# Altium schematic sheet 5-NAND_FLASH.SchDoc
size A4
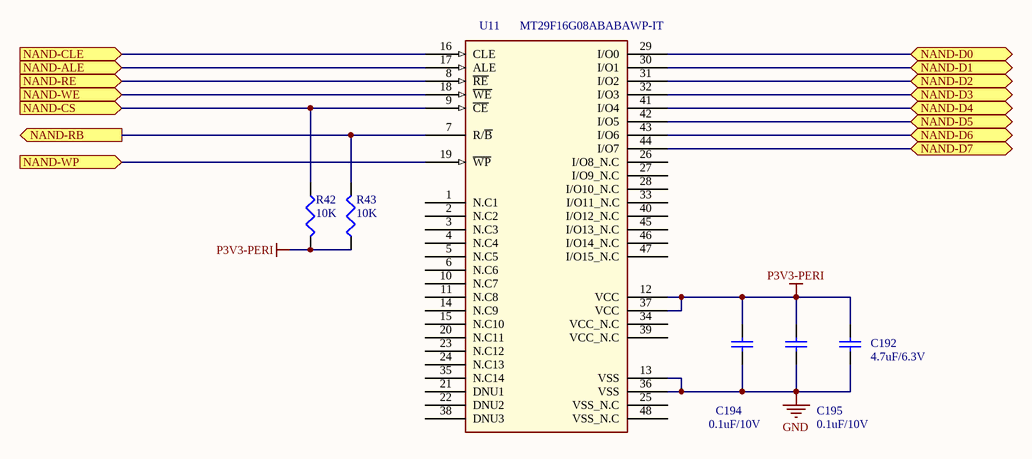
[diagram p0: 5-NAND_FLASH.SchDoc]

## Parts
C192  4.7uF/6.3V  [0603_CC]
C194  0.1uF/10V  [0402_CC]
C195  0.1uF/10V  [0402_CC]
R42  10K  [0402_CC]
R43  10K  [0402_CC]
U11  MT29F16G08ABABAWP-IT  [TSOP48]

## Ports
NAND-ALE (in), NAND-CLE (in), NAND-CS (in), NAND-D0 (bidir), NAND-D1 (bidir), NAND-D2 (bidir), NAND-D3 (bidir), NAND-D4 (bidir), NAND-D5 (bidir), NAND-D6 (bidir), NAND-D7 (bidir), NAND-RB (out), NAND-RE (in), NAND-WE (in), NAND-WP (in)

## Nets
GND: C192.2 C194.2 C195.2 U11.13(VSS) U11.36(VSS)
P3V3-PERI: C192.1 C194.1 C195.1 R42.2 R43.1 U11.12(VCC) U11.37(VCC)
NAND-ALE: U11.17(ALE) ; port NAND-ALE
NAND-CLE: U11.16(CLE) ; port NAND-CLE
NAND-CS: R42.1 U11.9(~{CE}) ; port NAND-CS
NAND-D0: U11.29(I/O0) ; port NAND-D0
NAND-D1: U11.30(I/O1) ; port NAND-D1
NAND-D2: U11.31(I/O2) ; port NAND-D2
NAND-D3: U11.32(I/O3) ; port NAND-D3
NAND-D4: U11.41(I/O4) ; port NAND-D4
NAND-D5: U11.42(I/O5) ; port NAND-D5
NAND-D6: U11.43(I/O6) ; port NAND-D6
NAND-D7: U11.44(I/O7) ; port NAND-D7
NAND-RB: R43.2 U11.7(R/~{B}) ; port NAND-RB
NAND-RE: U11.8(~{RE}) ; port NAND-RE
NAND-WE: U11.18(~{WE}) ; port NAND-WE
NAND-WP: U11.19(~{WP}) ; port NAND-WP

Not connected (* = marked no-connect by the designer): U11 1(N.C1) 2(N.C2) 3(N.C3) 4(N.C4) 5(N.C5) 6(N.C6) 10(N.C7) 11(N.C8) 14(N.C9) 15(N.C10) 20(N.C11) 21(DNU1) 22(DNU2) 23(N.C12) 24(N.C13) 25(VSS_N.C) 26(I/O8_N.C) 27(I/O9_N.C) 28(I/O10_N.C) 33(I/O11_N.C) 34(VCC_N.C) 35(N.C14) 38(DNU3) 39(VCC_N.C) 40(I/O12_N.C) 45(I/O13_N.C) 46(I/O14_N.C) 47(I/O15_N.C) 48(VSS_N.C)

## Library data of the parts
C192 C194 C195 = Cap: Capacitor; Published: 8-Jun-2000; LatestRevisionDate: 17-Jul-2002; LatestRevisionNote: Re-released for DXP Platform.; PackageReference: RAD-0.3; Publisher: Altium Limited; PackageDescription: Radial Cap, Thru-Hole; 2 Leads; 0.3 in Pin Spacing
R42 R43 = Res3: Resistor; Published: 8-Jun-2000; LatestRevisionDate: 29-May-2009; LatestRevisionNote: IPC-7351 Footprint Added.; PackageReference: J1-0603; Publisher: Altium Limited; PackageDescription: Chip Resistor
U11 = MT29F2GxxAAD: TEN: 2,7..3,6V; DESIG: NAND Flash Memoty 2Gb x 8; FAB: MICRON; DEV: CIS_TSOP48_01; VAL: MT29F2G08AADWP; BOI: TSOP48; RoHS: YES; REF: MT29F2G08AADWP